# Altium schematic sheet FPGA_Interconnect.SchDoc: LiveDesign Evaluation - Port Switcher
size A4; Organization: Altium Limited; Address1: L3, 12a Rodborough Rd; Address2: Frenchs Forest; Address3: NSW; Address4: Australia 2086; DocumentNumber: 2; SheetNumber: 2; SheetTotal: 5
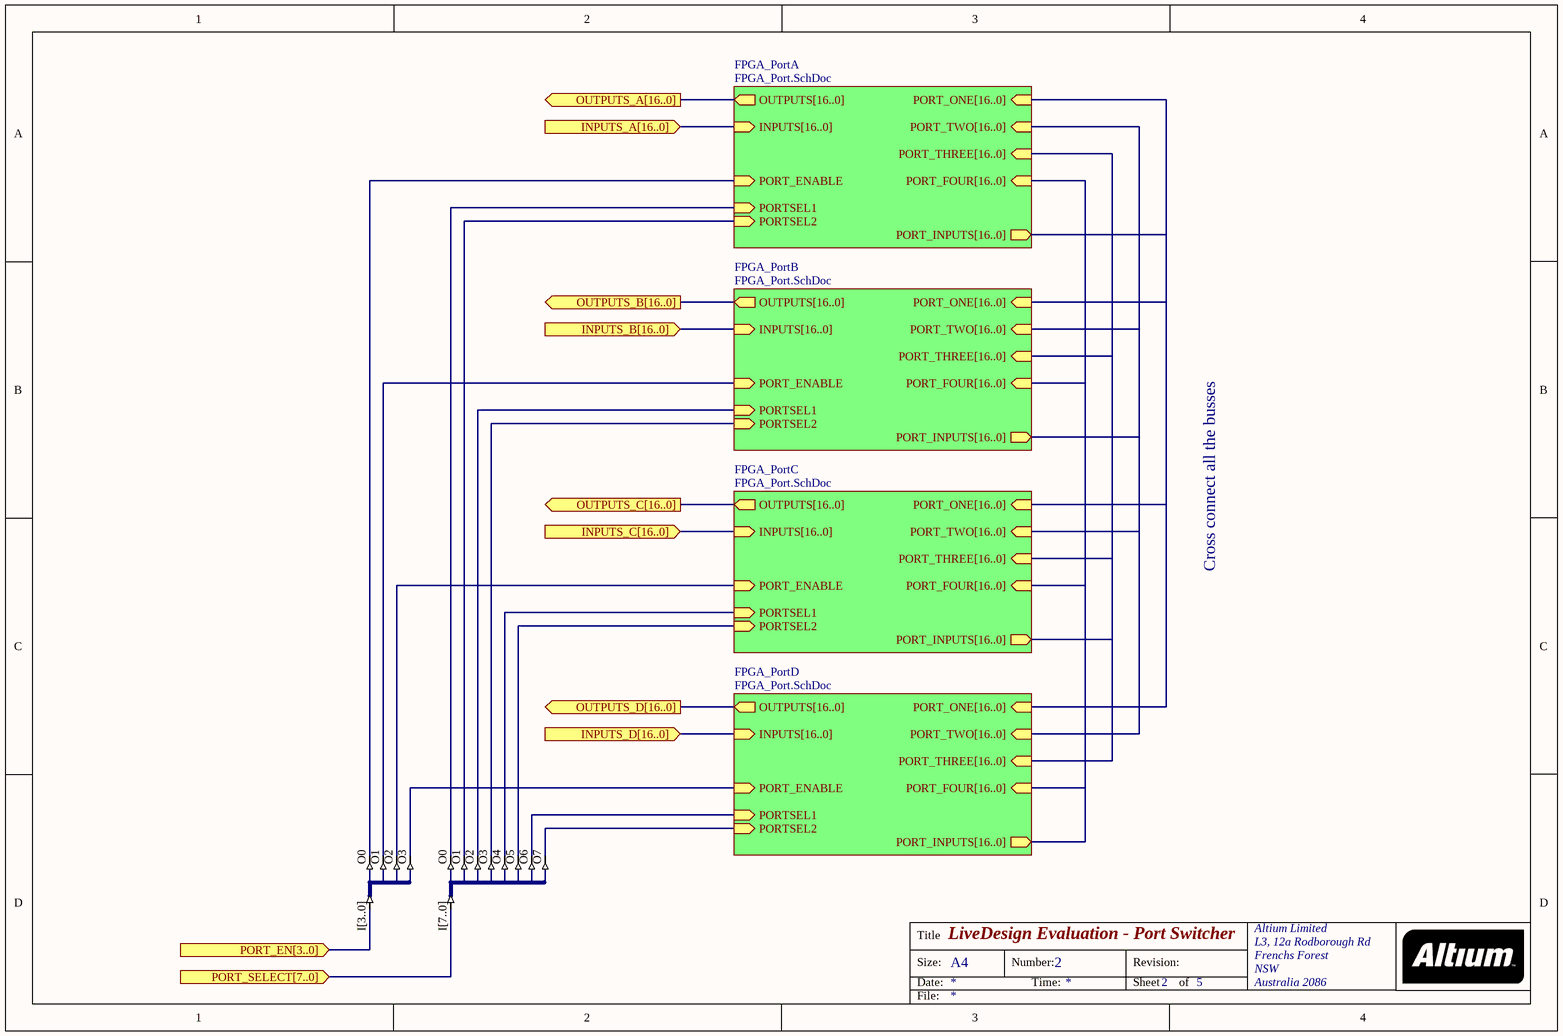
[diagram p0: FPGA_Interconnect.SchDoc]

## Parts
U1  J4B_4S  (value not drawn)
U2  J8B_8S  (value not drawn)

## Sub-sheets
FPGA_PortA = FPGA_Port.SchDoc: PORT_ONE[16..0] (in), PORTSEL1 (in), PORT_TWO[16..0] (in), PORT_THREE[16..0] (in), PORT_FOUR[16..0] (in), PORT_ENABLE (in), OUTPUTS[16..0] (out), PORTSEL2 (in), INPUTS[16..0] (in), PORT_INPUTS[16..0] (out)
FPGA_PortB = FPGA_Port.SchDoc: PORT_ONE[16..0] (in), PORTSEL1 (in), PORT_TWO[16..0] (in), PORT_THREE[16..0] (in), PORT_FOUR[16..0] (in), PORT_ENABLE (in), OUTPUTS[16..0] (out), PORTSEL2 (in), INPUTS[16..0] (in), PORT_INPUTS[16..0] (out)
FPGA_PortC = FPGA_Port.SchDoc: PORT_ONE[16..0] (in), PORTSEL1 (in), PORT_TWO[16..0] (in), PORT_THREE[16..0] (in), PORT_FOUR[16..0] (in), PORT_ENABLE (in), OUTPUTS[16..0] (out), PORTSEL2 (in), INPUTS[16..0] (in), PORT_INPUTS[16..0] (out)
FPGA_PortD = FPGA_Port.SchDoc: PORT_ONE[16..0] (in), PORTSEL1 (in), PORT_TWO[16..0] (in), PORT_THREE[16..0] (in), PORT_FOUR[16..0] (in), PORT_ENABLE (in), OUTPUTS[16..0] (out), PORTSEL2 (in), INPUTS[16..0] (in), PORT_INPUTS[16..0] (out)

## Ports
INPUTS_A[16..0] (in), INPUTS_B[16..0] (in), INPUTS_C[16..0] (in), INPUTS_D[16..0] (in), OUTPUTS_A[16..0] (out), OUTPUTS_B[16..0] (out), OUTPUTS_C[16..0] (out), OUTPUTS_D[16..0] (out), PORT_EN[3..0] (in), PORT_SELECT[7..0] (in)

## Nets
PORT_EN[3..0]: U1.I[3..0] ; port PORT_EN[3..0]
PORT_SELECT[7..0]: U2.I[7..0] ; port PORT_SELECT[7..0]
NetU1_O0: U1.O0 ; sheet FPGA_PortA/PORT_ENABLE
NetU1_O1: U1.O1 ; sheet FPGA_PortB/PORT_ENABLE
NetU1_O2: U1.O2 ; sheet FPGA_PortC/PORT_ENABLE
NetU1_O3: U1.O3 ; sheet FPGA_PortD/PORT_ENABLE
NetU2_O0: U2.O0 ; sheet FPGA_PortA/PORTSEL1
NetU2_O1: U2.O1 ; sheet FPGA_PortA/PORTSEL2
NetU2_O2: U2.O2 ; sheet FPGA_PortB/PORTSEL1
NetU2_O3: U2.O3 ; sheet FPGA_PortB/PORTSEL2
NetU2_O4: U2.O4 ; sheet FPGA_PortC/PORTSEL1
NetU2_O5: U2.O5 ; sheet FPGA_PortC/PORTSEL2
NetU2_O6: U2.O6 ; sheet FPGA_PortD/PORTSEL1
NetU2_O7: U2.O7 ; sheet FPGA_PortD/PORTSEL2

## Buses and harness runs
bus port INPUTS_A[16..0] = sheet FPGA_PortA/INPUTS[16..0]
bus port INPUTS_B[16..0] = sheet FPGA_PortB/INPUTS[16..0]
bus port INPUTS_C[16..0] = sheet FPGA_PortC/INPUTS[16..0]
bus port INPUTS_D[16..0] = sheet FPGA_PortD/INPUTS[16..0]
bus port OUTPUTS_A[16..0] = sheet FPGA_PortA/OUTPUTS[16..0]
bus port OUTPUTS_B[16..0] = sheet FPGA_PortB/OUTPUTS[16..0]
bus port OUTPUTS_C[16..0] = sheet FPGA_PortC/OUTPUTS[16..0]
bus port OUTPUTS_D[16..0] = sheet FPGA_PortD/OUTPUTS[16..0]
bus sheet FPGA_PortA/PORT_FOUR[16..0] = sheet FPGA_PortB/PORT_FOUR[16..0] = sheet FPGA_PortC/PORT_FOUR[16..0] = sheet FPGA_PortD/PORT_FOUR[16..0] = sheet FPGA_PortD/PORT_INPUTS[16..0]
bus sheet FPGA_PortA/PORT_INPUTS[16..0] = sheet FPGA_PortA/PORT_ONE[16..0] = sheet FPGA_PortB/PORT_ONE[16..0] = sheet FPGA_PortC/PORT_ONE[16..0] = sheet FPGA_PortD/PORT_ONE[16..0]
bus sheet FPGA_PortA/PORT_THREE[16..0] = sheet FPGA_PortB/PORT_THREE[16..0] = sheet FPGA_PortC/PORT_INPUTS[16..0] = sheet FPGA_PortC/PORT_THREE[16..0] = sheet FPGA_PortD/PORT_THREE[16..0]
bus sheet FPGA_PortA/PORT_TWO[16..0] = sheet FPGA_PortB/PORT_INPUTS[16..0] = sheet FPGA_PortB/PORT_TWO[16..0] = sheet FPGA_PortC/PORT_TWO[16..0] = sheet FPGA_PortD/PORT_TWO[16..0]

## Notes on the sheet
- Cross connect all the busses
- Title
- Size:
- Date:
- A4
- Number:
- Time:
- Revision:
- Sheet
- of
- File:

## Library data of the parts
U1 = J4B_4S: 4-Bit input bus to 4 Single pin outputs; ArchiveName: GENERIC; VHDLIB_SIM: GENERIC_LIB; Published: 29-Jan-2004; Publisher: Altium Limited; Core Revision: 1.00.00
U2 = J8B_8S: 8-Bit input bus to 8 single pin outputs; ArchiveName: GENERIC; VHDLIB_SIM: GENERIC_LIB; Published: 29-Jan-2004; Publisher: Altium Limited; Core Revision: 1.00.00